# EAGLE design esp-01_lite2 (EAGLE 8.7.0)
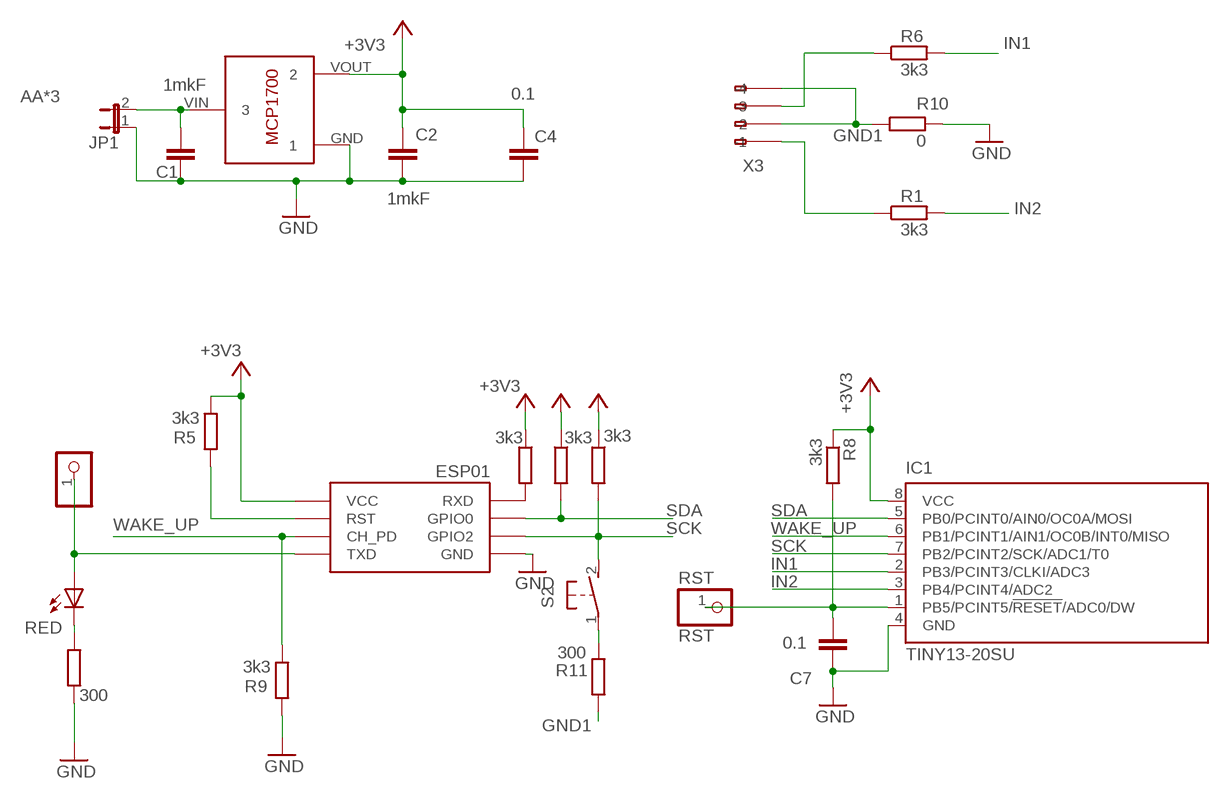
[diagram p0: schematic, sheet 1]

## Parts
C1  1mkF  C-EUC0805  [C0805]
C2  1mkF  C-EUC0805  [C0805]
C4  0.1  C-EUC0805  [C0805]
C7  0.1  C-EUC0805  [C0805]
IC1  TINY13-20SU  [8S2]
JP1  JP1E  [JP1]
LED1  RED  LEDSML0805  [SML0805]
LOG  LOG  PINHD-1X1  [1X01]
R1  3k3  R-EU_M0805  [M0805]
R2  3k3  R-EU_R0805  [R0805]
R3  3k3  R-EU_R0805  [R0805]
R4  300  R-EU_0207/2V  [0207/2V]
R5  3k3  R-EU_R0805  [R0805]
R6  3k3  R-EU_M0805  [M0805]
R7  3k3  R-EU_R0805  [R0805]
R8  3k3  R-EU_R0805  [R0805]
R9  3k3  R-EU_R0805  [R0805]
R10  0  R-EU_M0805  [M0805]
R11  300  R-EU_R0805  [R0805]
RST  RST  PINHD-1X1  [1X01]
S2  31-XX  [B3F-31XX]
U$1  ESP01  [ESP01]
U$2  MCP1700T-3302E/TT  [MCP1700T-3302E/TT]
X3  233-104  [233-104]

## Nets
+3V3: C2.1 C4.1 IC1.8(VCC) R2.1 R3.1 R5.1 R7.1 R8.1 U$1.VCC U$2.VOUT
AA*3: C1.1 JP1.2 U$2.VIN
GND: C1.2 C2.2 C4.2 C7.1 IC1.4(GND) JP1.1 R4.2 R9.2 R10.2 U$1.GND U$2.GND
GND1: R10.1 R11.2 X3.A2(-2) X3.A4(-4)
IN1: IC1.2(PB3/PCINT3/CLKI/ADC3) R6.2
IN2: IC1.3(PB4/PCINT4/ADC2) R1.2
N$1: LED1.A LOG.1 U$1.TX(TXD)
N$2: R11.1 S2.1(P)
N$3: R6.1 X3.A3(-3)
N$4: R1.1 X3.A1(-1)
N$6: LED1.C R4.1
N$11: R5.2 U$1.RST
N$13: C7.2 IC1.1(PB5/PCINT5/!RESET!/ADC0/DW) R8.2 RST.1
RX: R7.2 U$1.RX(RXD)
SCK: IC1.7(PB2/PCINT2/SCK/ADC1/T0) R2.2 S2.2(S) U$1.GPIO2
SDA: IC1.5(PB0/PCINT0/AIN0/OC0A/MOSI) R3.2 U$1.GPIO0
WAKE_UP: IC1.6(PB1/PCINT1/AIN1/OC0B/INT0/MISO) R9.1 U$1.CH_PD
Unconnected: X3.B1(B-1) X3.B2(B-2) X3.B3(B-3) X3.B4(B-4)

## Library data of the parts
C1 C2 C7 = resistor:C-EU: CAPACITOR, European symbol
C4 = rcl:C-EU: CAPACITOR, European symbol; SPICEPREFIX: C
IC1 = atmel:TINY13: 8-bit AVR Microcontroller with 1K Bytes In-System Programmable Flash Source: http://www.atmel.com/dyn/resources/prod_documents/2535S.pdf; MPN: ATTINY13-20SU; OC_FARNELL: 9171568; OC_NEWARK: 96K6522
JP1 = jumper:JP1E: JUMPER
LED1 = led:LED: LED OSRAM: - CHIPLED LG R971, LG N971, LY N971, LG Q971, LY Q971, LO R971, LY R971 LH N974, LH R974 LS Q976, LO Q976, LY Q976 LO Q996 - Hyper CHIPLED LW Q18S LB Q993, LB Q99A, LB R99A - SideLED LS A670, LO A670, LY A670, LG A670, LP A670 LB A673, LV A673, LT A673, LW A673 LH A674 LY A675 LS A676, LA A676, LO A676, LY A676, LW A676 LS A679, LY A679, LG A679 - Hyper Micro SIDELED® LS Y876, LA Y876, LO Y876, LY Y876 LT Y87S - SmartLED LW L88C, LW L88S LB L89C, LB L89S, LG L890 LS L89K, LO L89K, LY L89K LS L896, LA L896, LO L896, LY L896 - TOPLED LS T670, LO T670, LY T670, LG T670, LP T670 LSG T670, LSP T670, LSY T670, LOP T670, LYG T670 LG T671, LOG T671, LSG T671 LB T673, LV T673, LT T673, LW T673 LH T674 LS T676, LA T676, LO T676, LY T676, LB T676, LH T676, LSB T676, LW T676 LB T67C, LV T67C, LT T67C, LS T67K, LO T67K, LY T67K, LW E67C LS E67B, LA E67B, LO E67B, LY E67B, LB E67C, LV E67C, LT E67C LW T67C LS T679, LY T679, LG T679 LS T770, LO T770, LY T770, LG T770, LP T770 LB T773, LV T773, LT T773, LW T773 LH T774 LS E675, LA E675, LY E675, LS T675 LS T776, LA T776, LO T776, LY T776, LB T776 LHGB T686 LT T68C, LB T68C - Hyper Mini TOPLED® LB M676 - Mini TOPLED Santana® LG M470 LS M47K, LO M47K, LY M47K Source: http://www.osram.convergy.de LUXEON: - LUMILED® LXK2-PW12-R00, LXK2-PW12-S00, LXK2-PW14-U00, LXK2-PW14-V00 LXK2-PM12-R00, LXK2-PM12-S00, LXK2-PM14-U00 LXK2-PE12-Q00, LXK2-PE12-R00, LXK2-PE12-S00, LXK2-PE14-T00, LXK2-PE14-U00 LXK2-PB12-K00, LXK2-PB12-L00, LXK2-PB12-M00, LXK2-PB14-N00, LXK2-PB14-P00, LXK2-PB14-Q00 LXK2-PR12-L00, LXK2-PR12-M00, LXK2-PR14-Q00, LXK2-PR14-R00 LXK2-PD12-Q00, LXK2-PD12-R00, LXK2-PD12-S00 LXK2-PH12-R00, LXK2-PH12-S00 LXK2-PL12-P00, LXK2-PL12-Q00, LXK2-PL12-R00 Source: www.luxeon.com KINGBRIGHT: KA-3528ASYC Source: www.kingbright.com
LOG RST = pinhead:PINHD-1X1: PIN HEADER
R1 = resistor:R-EU_: RESISTOR, European symbol; SPICEPREFIX: R
R2 R5 R7 R9 R11 = rcl:R-EU_: RESISTOR, European symbol; OM: 3k6
R3 R8 = rcl:R-EU_: RESISTOR, European symbol; OM: 3k6; SPICEPREFIX: R
R4 = rcl:R-EU_: RESISTOR, European symbol; OM: 200; SPICEPREFIX: R
R6 R10 = resistor:R-EU_: RESISTOR, European symbol
S2 = switch-omron:31-XX: OMRON SWITCH; MPN: B3F-3100; OC_FARNELL: 959704; OC_NEWARK: 36M3582
U$1 = esp8266modules:ESP01: ESP8266 Wifi module 01
U$2 = MCP1700T-3302E_TT:MCP1700T-3302E/TT: Microchip LDO "MCP1700" in a 3-Pin SOT-23 package. ID: MCP1700T-3302E/TT
X3 = con-wago255:233-104: WAGO; MPN: 233-104; OC_FARNELL: unknown; OC_NEWARK: 28K9046

## Board
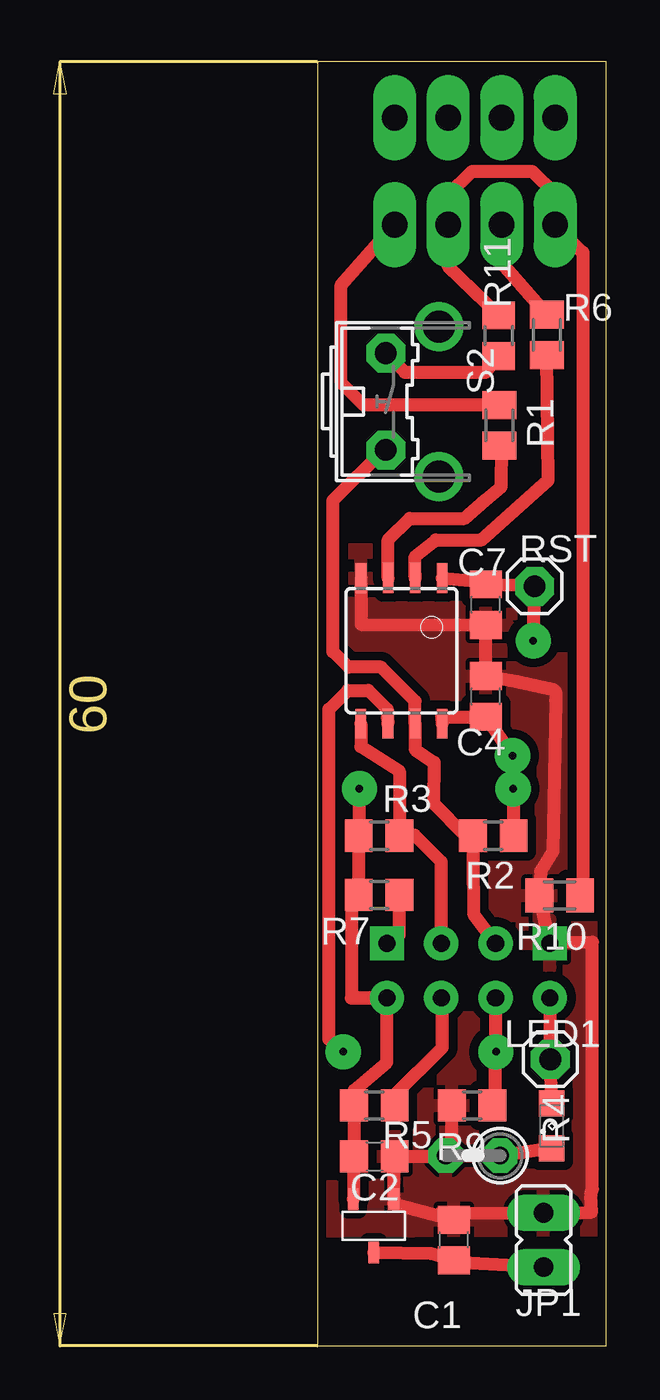
[diagram p1: board, top side]
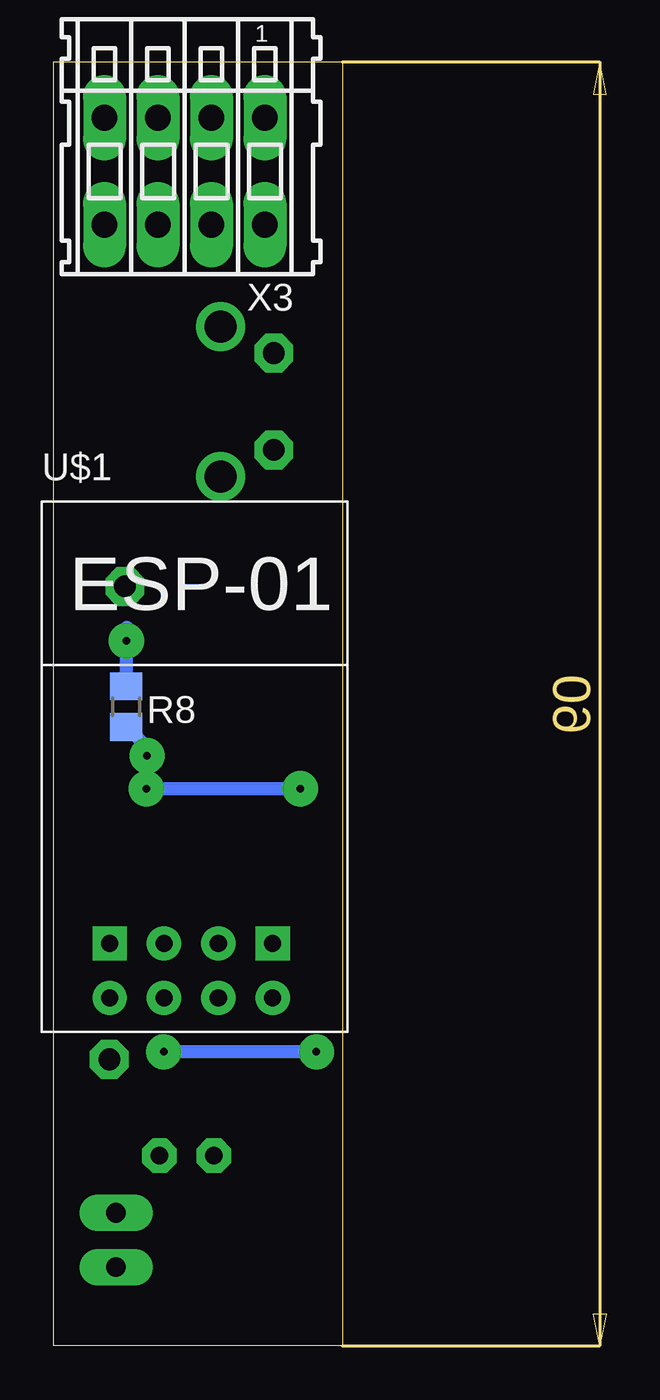
[diagram p2: board, bottom side, seen from below]

Size 13.5 x 60 mm. Coordinates in mm from the lower left corner, seen from the top.
Outline: 0,0 13.5,0 13.5,60 0,60 0,0
Copper layers (1*16): Top 0.035mm / dielectric 1.55mm / Bottom 0.035mm
Design rules "eC_2Layer_PClass6_BaseCopperO35 *": minimum track width 0.15mm, minimum drill 0.35mm, track to track 0.4mm, track to pad 0.5mm, pad to pad 0.5mm, via to via 0.3mm, smd to smd 0mil, copper to edge 0.25mm, drill to drill 0.35mm, minimum pad ring 0.4mm, minimum via ring 0.65mm, stop-mask expansion 0mil, vias tented up to drill 0.45mm, thermal gap 0.2mm

### Footprints (pad centres in the part's own frame; a part is rotated, then mirrored left to right if it is on the bottom)
C0805 = smd 1.3 x 1.5: 1 -0.95,0; 2 0.95,0
8S2 = smd 0.5 x 1.4: 1 -1.905,-3.404; 2 -0.645,-3.404; 3 0.625,-3.404; 4 1.895,-3.404; 5 1.905,3.404; 6 0.635,3.404; 7 -0.635,3.404; 8 -1.905,3.404
JP1 = drill 0.914 long: 1 0,-1.27; 2 0,1.27
SML0805 = smd 1.2 x 1.2: A 1.05,0; C -1.05,0
1X01 = drill 1.016 octagon: 1 0,0
M0805 = smd 1.3 x 1.6: 1 -0.95,0; 2 0.95,0
R0805 = smd 1.3 x 1.5: 1 -0.95,0; 2 0.95,0
0207/2V = drill 0.813 octagon: 1 -1.27,0; 2 1.27,0
B3F-31XX = drill 1.016 octagon: 1 -2.261,-1.245; 2 2.261,-1.245 | drill 1.499 pad 2.159: 3 -3.505,1.245; 4 3.505,1.245
ESP01 = drill 0.8: CH_PD -1.285,-8.178; GPIO0 1.255,-5.638; GPIO2 -1.285,-5.638; RST 1.255,-8.178; TX -3.825,-8.178; VCC 3.795,-8.178 | drill 0.8 square: GND -3.825,-5.638; RX 3.795,-5.638
MCP1700T-3302E/TT = smd 0.5 x 1: GND -0.95,-1.25; VIN 0,1.25; VOUT 0.95,-1.25
233-104 = drill 1.2 long: A1 -3.75,2.5; A2 -1.25,2.5; A3 1.25,2.5; A4 3.75,2.5; B1 -3.75,-2.5; B2 -1.25,-2.5; B3 1.25,-2.5; B4 3.75,-2.5

### Placement (x,y rotation side)
C1  6.38,4.95 90 top
C2  2.67,8.86 0 top
C4  7.87,30.35 90 top
C7  7.87,34.64 90 top
IC1  3.94,32.48 180 top
JP1  10.57,4.95 180 top
LED1  10.95,10.29 90 top
LOG  10.89,13.4 0 top
R1  8.51,43.02 270 top
R2  8.22,23.84 180 top
R3  2.89,23.84 0 top
R4  7.27,8.89 180 top
R5  2.67,11.24 0 top
R6  10.73,47.24 270 top
R7  2.89,21.08 0 top
R8  10.1,29.88 90 bottom
R9  7.24,11.24 180 top
R10  11.33,21.05 180 top
R11  8.48,47.21 90 top
RST  10.16,35.5 90 top
S2  4.45,44.13 270 top
U$1  7.05,24.45 0 bottom
U$2  2.64,5.62 180 top
X3  7.37,54.9 180 bottom

### Tracks (layer width: path | path; a pad name or v marks a point on that pad's centre or on a via)
+3V3  (via drill 0.35)
  Top 0.61: 1.59,16.26 1.59,20.98 R7.1 R3.1 1.97,23.87 v1.97,26.04 | 1.59,16.26 3.24,16.26 U$1.VCC | 1.59,16.26 3.27,16.26 3.25,16.02 3.25,13.26 1.72,11.95 R5.1 C2.1 | R2.1 9.17,25.12 9.17,26.1 v9.16,26.04 v9.12,27.58 C4.1 5.82,29.4 IC1.8 | C2.1 1.91,9.34 | C2.1 1.69,8.83 U$2.VOUT
  Bottom 0.61: v1.97,26.04 5.76,26.04 v9.16,26.04 | R8.1 9.16,27.99 v9.12,27.58
AA*3
  Top 0.61: U$2.VIN 5.29,4.32 C1.1 7.15,3.87 JP1.2
GND
  Top 0.61: IC1.4 2.04,33.72 C7.1 C4.2 9.24,31.07 11.05,30.67 11.14,30.57 11.14,30.16 11.02,23.11 10.45,22.19 R10.2 10.83,18.85 U$1.GND 10.87,18.83 10.86,18.89 12.86,18.86 12.86,7.34 12.79,7.05 12.83,6.25 JP1.1 5.71,6.19 C1.2 3.57,6.65 U$2.GND 3.58,8.83 C2.2 5.97,8.86 R4.2 6.29,9.18 R9.2
  pour Top (isolate 0.406): 13.46,5.43 13.49,37.22 0.06,37.2 0.09,5.36
GND1
  Top 0.61: R11.2 6.12,50.46 X3.A2 6.12,53.77 7.24,54.9 10.03,54.9 11.12,53.81 X3.A4 12.41,51.1 12.41,21.46 R10.1
IN1
  Top 0.61: IC1.2 4.57,36.06 4.57,36.89 5.53,37.66 7.68,37.66 10.79,40.46 R6.2
IN2
  Top 0.61: IC1.3 3.31,37.67 4.32,38.67 6.88,38.67 7.87,39.53 8.6,40.16 8.64,42.04 R1.2
N$1
  Top 0.61: LED1.A LOG.1 10.87,14.13 U$1.TX
N$2
  Top 0.61: S2.1 4.1,45.5 7.87,45.5 R11.1
N$3
  Top 0.61: R6.1 8.62,50.59 X3.A3
N$4
  Top 0.61: R1.1 2.16,43.97 1.11,45.02 1.11,49.57 X3.A1
N$6
  Top 0.61: LED1.C R4.1
N$11
  Top 0.61: R5.2 3.62,11.71 5.84,13.94 5.84,16.22 U$1.RST
N$13  (via drill 0.35)
  Top 0.61: IC1.1 7.65,35.73 C7.2 10.07,35.56 RST.1 v10.1,32.96
  Bottom 0.61: R8.2 10.06,33.59 v10.1,32.96
RX
  Top 0.61: U$1.RX 3.84,19.19 R7.2
SCK
  Top 0.61: U$1.GPIO2 8.32,18.82 7.3,20.19 7.27,22.86 R2.2 6.95,23.84 5.43,25.37 5.46,27.28 4.57,27.88 IC1.7 4.57,30.13 2.98,31.72 1.46,31.72 0.73,32.45 0.73,39.5 3.1,41.87 S2.2
SDA
  Top 0.61: IC1.5 2.03,28 3.84,26.86 R3.2 4.54,23.88 5.78,22.64 5.78,18.82 U$1.GPIO0
WAKE_UP  (via drill 0.35)
  Top 0.61: IC1.6 3.27,29.36 3.27,29.75 2.38,30.64 1.43,30.64 0.54,29.75 0.54,14.35 v1.21,13.75 | U$1.CH_PD 8.33,13.73 | 8.33,13.73 v8.35,13.75 | R9.1 8.33,11.26 8.33,13.73
  Bottom 0.61: v1.21,13.75 v8.35,13.75